# Altium schematic sheet HE.SchDoc
size A4
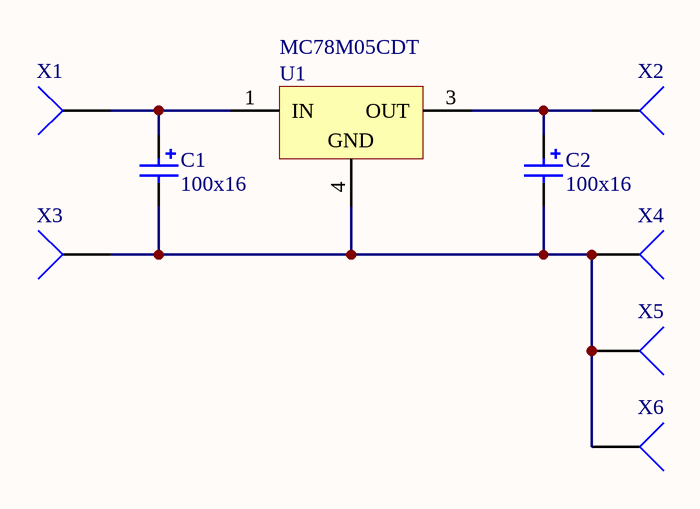
[diagram p0: HE.SchDoc]

## Parts
C1  value 100x16  [el3]
C2  value 100x16  [el3]
U1  MC78M05CDT  [SIP-G3/C7]
X1  (no value)  [PIN1]
X2  (no value)  [PIN1]
X3  (no value)  [PIN1]
X4  (no value)  [PIN1]
X5  (no value)  [PIN1]
X6  (no value)  [PIN1]

## Nets
NetC1_1: C1.1 U1.1(IN) X1.1
NetC1_2: C1.2 C2.2 U1.4(GND) X3.1 X4.1 X5.1 X6.1
NetC2_1: C2.1 U1.3(OUT) X2.1

## Library data of the parts
C1 C2 = Cap Pol: Polarized Capacitor (Radial); Manufacturer: Generic Components; Class I: Passive; Published: 8-Jun-2000; Revision: July-2002: Re-released for DXP Platform.; Publisher: Altium Limited; Class II: Capacitor
U1 = MC78M05CDT: 3-Terminal Medium-Current Positive Fixed Voltage Regulator; Manufacturer: Motorola; Class I: Power Management; Note: Heatsink suface connected to pin 4.; Published: 15-Apr-2002; Datasheet: Linear and Interface Integrated Circuits, DL128 Rev2 (1988); Package Reference: 369A-03; Publisher: Altium Limited; Class II: Voltage Regulator
X1-X6 = Socket: Manufacturer: Generic Components; Class I: Connector; Revision: July-2002: Re-released for DXP Platform.; Publisher: Altium Limited